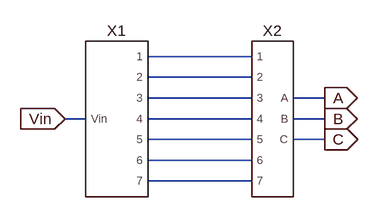
[diagram p0: schematic flash3bits.asc]
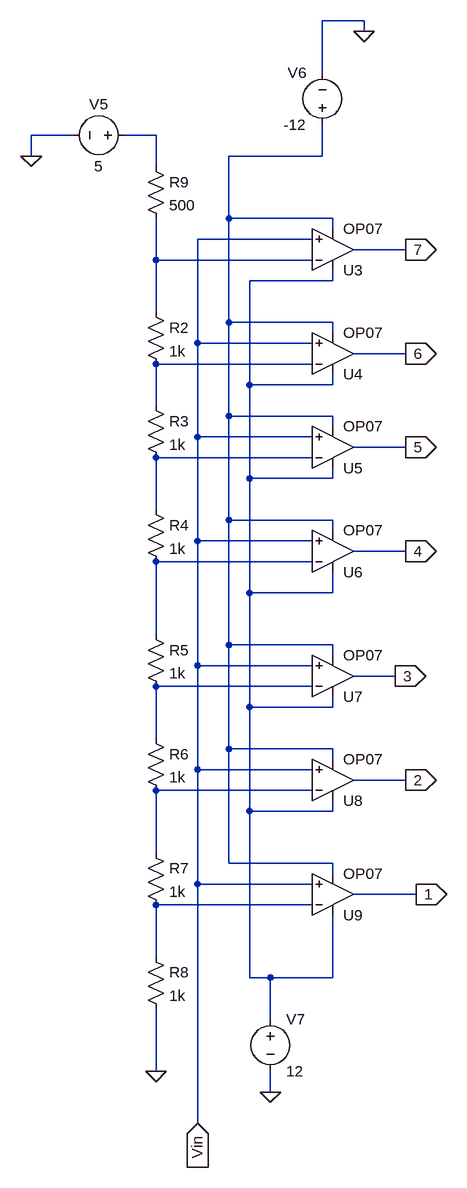
[diagram p1: sub-circuit 3bitscomparator.asc]
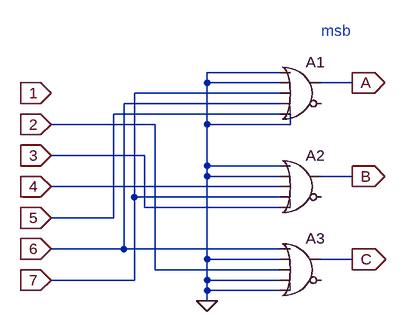
[diagram p2: sub-circuit 7dec3bits.asc]
flash3bits.asc, the LTspice schematic file:
Version 4
SHEET 1 880 680
WIRE 336 64 176 64
WIRE 336 96 176 96
WIRE 336 128 176 128
WIRE 448 128 400 128
WIRE 80 160 48 160
WIRE 336 160 176 160
WIRE 448 160 400 160
WIRE 336 192 176 192
WIRE 448 192 400 192
WIRE 336 224 176 224
WIRE 336 256 176 256
FLAG 448 128 A
IOPIN 448 128 Out
FLAG 448 160 B
IOPIN 448 160 Out
FLAG 448 192 C
IOPIN 448 192 Out
FLAG 48 160 Vin
IOPIN 48 160 In
SYMBOL 3bitsComparator 128 160 R0
SYMATTR InstName X1
SYMBOL 7dec3bits 368 160 R0
SYMATTR InstName X2

3bitscomparator.asc, the sub-circuit schematic file:
Version 4
SHEET 1 2344 1544
WIRE 1296 -432 1232 -432
WIRE 1296 -416 1296 -432
WIRE 1232 -352 1232 -432
WIRE 848 -256 784 -256
WIRE 976 -256 928 -256
WIRE 784 -224 784 -256
WIRE 1232 -224 1232 -272
WIRE 1232 -224 1088 -224
WIRE 976 -208 976 -256
WIRE 1088 -128 1088 -224
WIRE 1248 -128 1088 -128
WIRE 1248 -112 1248 -128
WIRE 1216 -96 1040 -96
WIRE 1360 -80 1280 -80
WIRE 976 -64 976 -128
WIRE 1216 -64 976 -64
WIRE 1248 -32 1248 -48
WIRE 1248 -32 1120 -32
WIRE 976 16 976 -64
WIRE 1088 32 1088 -128
WIRE 1248 32 1088 32
WIRE 1248 48 1248 32
WIRE 1040 64 1040 -96
WIRE 1216 64 1040 64
WIRE 1360 80 1280 80
WIRE 1216 96 976 96
WIRE 1120 128 1120 -32
WIRE 1248 128 1248 112
WIRE 1248 128 1120 128
WIRE 976 160 976 96
WIRE 1088 176 1088 32
WIRE 1248 176 1088 176
WIRE 1248 192 1248 176
WIRE 1040 208 1040 64
WIRE 1216 208 1040 208
WIRE 1360 224 1280 224
WIRE 1216 240 976 240
WIRE 1120 272 1120 128
WIRE 1248 272 1248 256
WIRE 1248 272 1120 272
WIRE 976 320 976 240
WIRE 1088 336 1088 176
WIRE 1248 336 1088 336
WIRE 1248 352 1248 336
WIRE 1040 368 1040 208
WIRE 1216 368 1040 368
WIRE 1360 384 1280 384
WIRE 1216 400 976 400
WIRE 1120 448 1120 272
WIRE 1248 448 1248 416
WIRE 1248 448 1120 448
WIRE 976 512 976 400
WIRE 1088 528 1088 336
WIRE 1248 528 1088 528
WIRE 1248 544 1248 528
WIRE 1040 560 1040 368
WIRE 1216 560 1040 560
WIRE 1344 576 1280 576
WIRE 1216 592 976 592
WIRE 1120 624 1120 448
WIRE 1248 624 1248 608
WIRE 1248 624 1120 624
WIRE 976 672 976 592
WIRE 1088 688 1088 528
WIRE 1248 688 1088 688
WIRE 1248 704 1248 688
WIRE 1040 720 1040 560
WIRE 1216 720 1040 720
WIRE 1360 736 1280 736
WIRE 1216 752 976 752
WIRE 1120 784 1120 624
WIRE 1248 784 1248 768
WIRE 1248 784 1120 784
WIRE 976 848 976 752
WIRE 1088 864 1088 688
WIRE 1248 864 1088 864
WIRE 1248 880 1248 864
WIRE 1040 896 1040 720
WIRE 1216 896 1040 896
WIRE 1376 912 1280 912
WIRE 1216 928 976 928
WIRE 976 1008 976 928
WIRE 1120 1040 1120 784
WIRE 1152 1040 1120 1040
WIRE 1248 1040 1248 944
WIRE 1248 1040 1152 1040
WIRE 1152 1104 1152 1040
WIRE 976 1184 976 1088
WIRE 1152 1216 1152 1184
WIRE 1040 1264 1040 896
FLAG 1296 -416 0
FLAG 976 1184 0
FLAG 1152 1216 0
FLAG 1376 912 1
IOPIN 1376 912 Out
FLAG 1360 736 2
IOPIN 1360 736 Out
FLAG 1344 576 3
IOPIN 1344 576 Out
FLAG 1360 384 4
IOPIN 1360 384 Out
FLAG 1360 224 5
IOPIN 1360 224 Out
FLAG 1360 80 6
IOPIN 1360 80 Out
FLAG 1360 -80 7
IOPIN 1360 -80 Out
FLAG 784 -224 0
FLAG 1040 1264 Vin
IOPIN 1040 1264 In
SYMBOL res 960 0 R0
SYMATTR InstName R2
SYMATTR Value 1k
SYMBOL res 960 144 R0
SYMATTR InstName R3
SYMATTR Value 1k
SYMBOL res 960 304 R0
SYMATTR InstName R4
SYMATTR Value 1k
SYMBOL Opamps\\OP07 1248 -16 M180
SYMATTR InstName U3
SYMBOL Opamps\\OP07 1248 144 M180
SYMATTR InstName U4
SYMBOL Opamps\\OP07 1248 288 M180
SYMATTR InstName U5
SYMBOL Opamps\\OP07 1248 448 M180
SYMATTR InstName U6
SYMBOL voltage 944 -256 R90
WINDOW 0 -32 56 VBottom 2
WINDOW 3 32 56 VTop 2
WINDOW 123 0 0 Left 0
WINDOW 39 0 0 Left 0
SYMATTR InstName V5
SYMATTR Value 5
SYMBOL voltage 1232 -256 R180
WINDOW 0 24 96 Left 2
WINDOW 3 24 16 Left 2
WINDOW 123 0 0 Left 0
WINDOW 39 0 0 Left 0
SYMATTR InstName V6
SYMATTR Value -12
SYMBOL res 960 496 R0
SYMATTR InstName R5
SYMATTR Value 1k
SYMBOL res 960 656 R0
SYMATTR InstName R6
SYMATTR Value 1k
SYMBOL res 960 832 R0
SYMATTR InstName R7
SYMATTR Value 1k
SYMBOL Opamps\\OP07 1248 640 M180
SYMATTR InstName U7
SYMBOL Opamps\\OP07 1248 800 M180
SYMATTR InstName U8
SYMBOL Opamps\\OP07 1248 976 M180
SYMATTR InstName U9
SYMBOL voltage 1152 1088 R0
WINDOW 123 0 0 Left 0
WINDOW 39 0 0 Left 0
SYMATTR InstName V7
SYMATTR Value 12
SYMBOL res 960 992 R0
SYMATTR InstName R8
SYMATTR Value 1k
SYMBOL res 960 -224 R0
SYMATTR InstName R9
SYMATTR Value 500

7dec3bits.asc, the sub-circuit schematic file:
Version 4
SHEET 1 880 680
WIRE 240 16 128 16
WIRE 128 32 128 16
WIRE 240 32 128 32
WIRE 352 32 304 32
WIRE 240 48 16 48
WIRE 240 64 0 64
WIRE 240 80 -16 80
WIRE 48 96 -112 96
WIRE 128 96 128 32
WIRE 256 96 256 80
WIRE 256 96 128 96
WIRE 32 144 -112 144
WIRE 128 160 128 96
WIRE 240 160 128 160
WIRE 128 176 128 160
WIRE 240 176 128 176
WIRE 352 176 304 176
WIRE 240 192 -112 192
WIRE 16 208 16 48
WIRE 240 208 16 208
WIRE 32 224 32 144
WIRE 240 224 32 224
WIRE -16 240 -16 80
WIRE -16 240 -112 240
WIRE 0 288 0 64
WIRE 0 288 -112 288
WIRE 240 288 0 288
WIRE 128 304 128 176
WIRE 240 304 128 304
WIRE 352 304 304 304
WIRE 48 320 48 96
WIRE 240 320 48 320
WIRE 16 336 16 208
WIRE 16 336 -112 336
WIRE 128 336 128 304
WIRE 240 336 128 336
WIRE 128 352 128 336
WIRE 240 352 128 352
WIRE 128 368 128 352
FLAG 128 368 0
FLAG 352 32 A
IOPIN 352 32 Out
FLAG 352 176 B
IOPIN 352 176 Out
FLAG 352 304 C
IOPIN 352 304 Out
FLAG -112 48 1
IOPIN -112 48 In
FLAG -112 96 2
IOPIN -112 96 In
FLAG -112 144 3
IOPIN -112 144 In
FLAG -112 192 4
IOPIN -112 192 In
FLAG -112 240 5
IOPIN -112 240 In
FLAG -112 288 6
IOPIN -112 288 In
FLAG -112 336 7
IOPIN -112 336 In
SYMBOL Digital\\or 272 -16 R0
SYMATTR InstName A1
SYMBOL Digital\\or 272 128 R0
SYMATTR InstName A2
SYMBOL Digital\\or 272 256 R0
SYMATTR InstName A3
TEXT 304 -48 Left 2 ;msb

The netlist it stands for:
* flash3bits.asc
XX1 Vin N001 N002 N003 N004 N005 N006 N007 3bitscomparator
XX2 N001 N002 N003 N004 N005 N006 N007 A B C 7dec3bits

* block symbol definitions
.subckt 3bitscomparator Vin 1 2 3 4 5 6 7
R2 N003 N005 1k
R3 N005 N006 1k
R4 N006 N007 1k
XU3 Vin N003 N004 N002 7 LT1001  ; OP07, pins In+ In- V+ V- OUT
XU4 Vin N005 N004 N002 6 LT1001  ; OP07, pins In+ In- V+ V- OUT
XU5 Vin N006 N004 N002 5 LT1001  ; OP07, pins In+ In- V+ V- OUT
XU6 Vin N007 N004 N002 4 LT1001  ; OP07, pins In+ In- V+ V- OUT
V5 N001 0 5
V6 N002 0 -12
R5 N007 N008 1k
R6 N008 N009 1k
R7 N009 N010 1k
XU7 Vin N008 N004 N002 3 LT1001  ; OP07, pins In+ In- V+ V- OUT
XU8 Vin N009 N004 N002 2 LT1001  ; OP07, pins In+ In- V+ V- OUT
XU9 Vin N010 N004 N002 1 LT1001  ; OP07, pins In+ In- V+ V- OUT
V7 N004 0 12
R8 N010 0 1k
R9 N001 N003 500
.ends 3bitscomparator

.subckt 7dec3bits 1 2 3 4 5 6 7 A B C
A1 0 0 7 6 5 0 A 0 OR
A2 0 0 4 7 3 0 B 0 OR
A3 6 0 2 0 0 0 C 0 OR
* msb
.ends 7dec3bits

.lib LTC.lib
.backanno
.end